# EAGLE design InstrDigitizer (EAGLE 8.0.1)
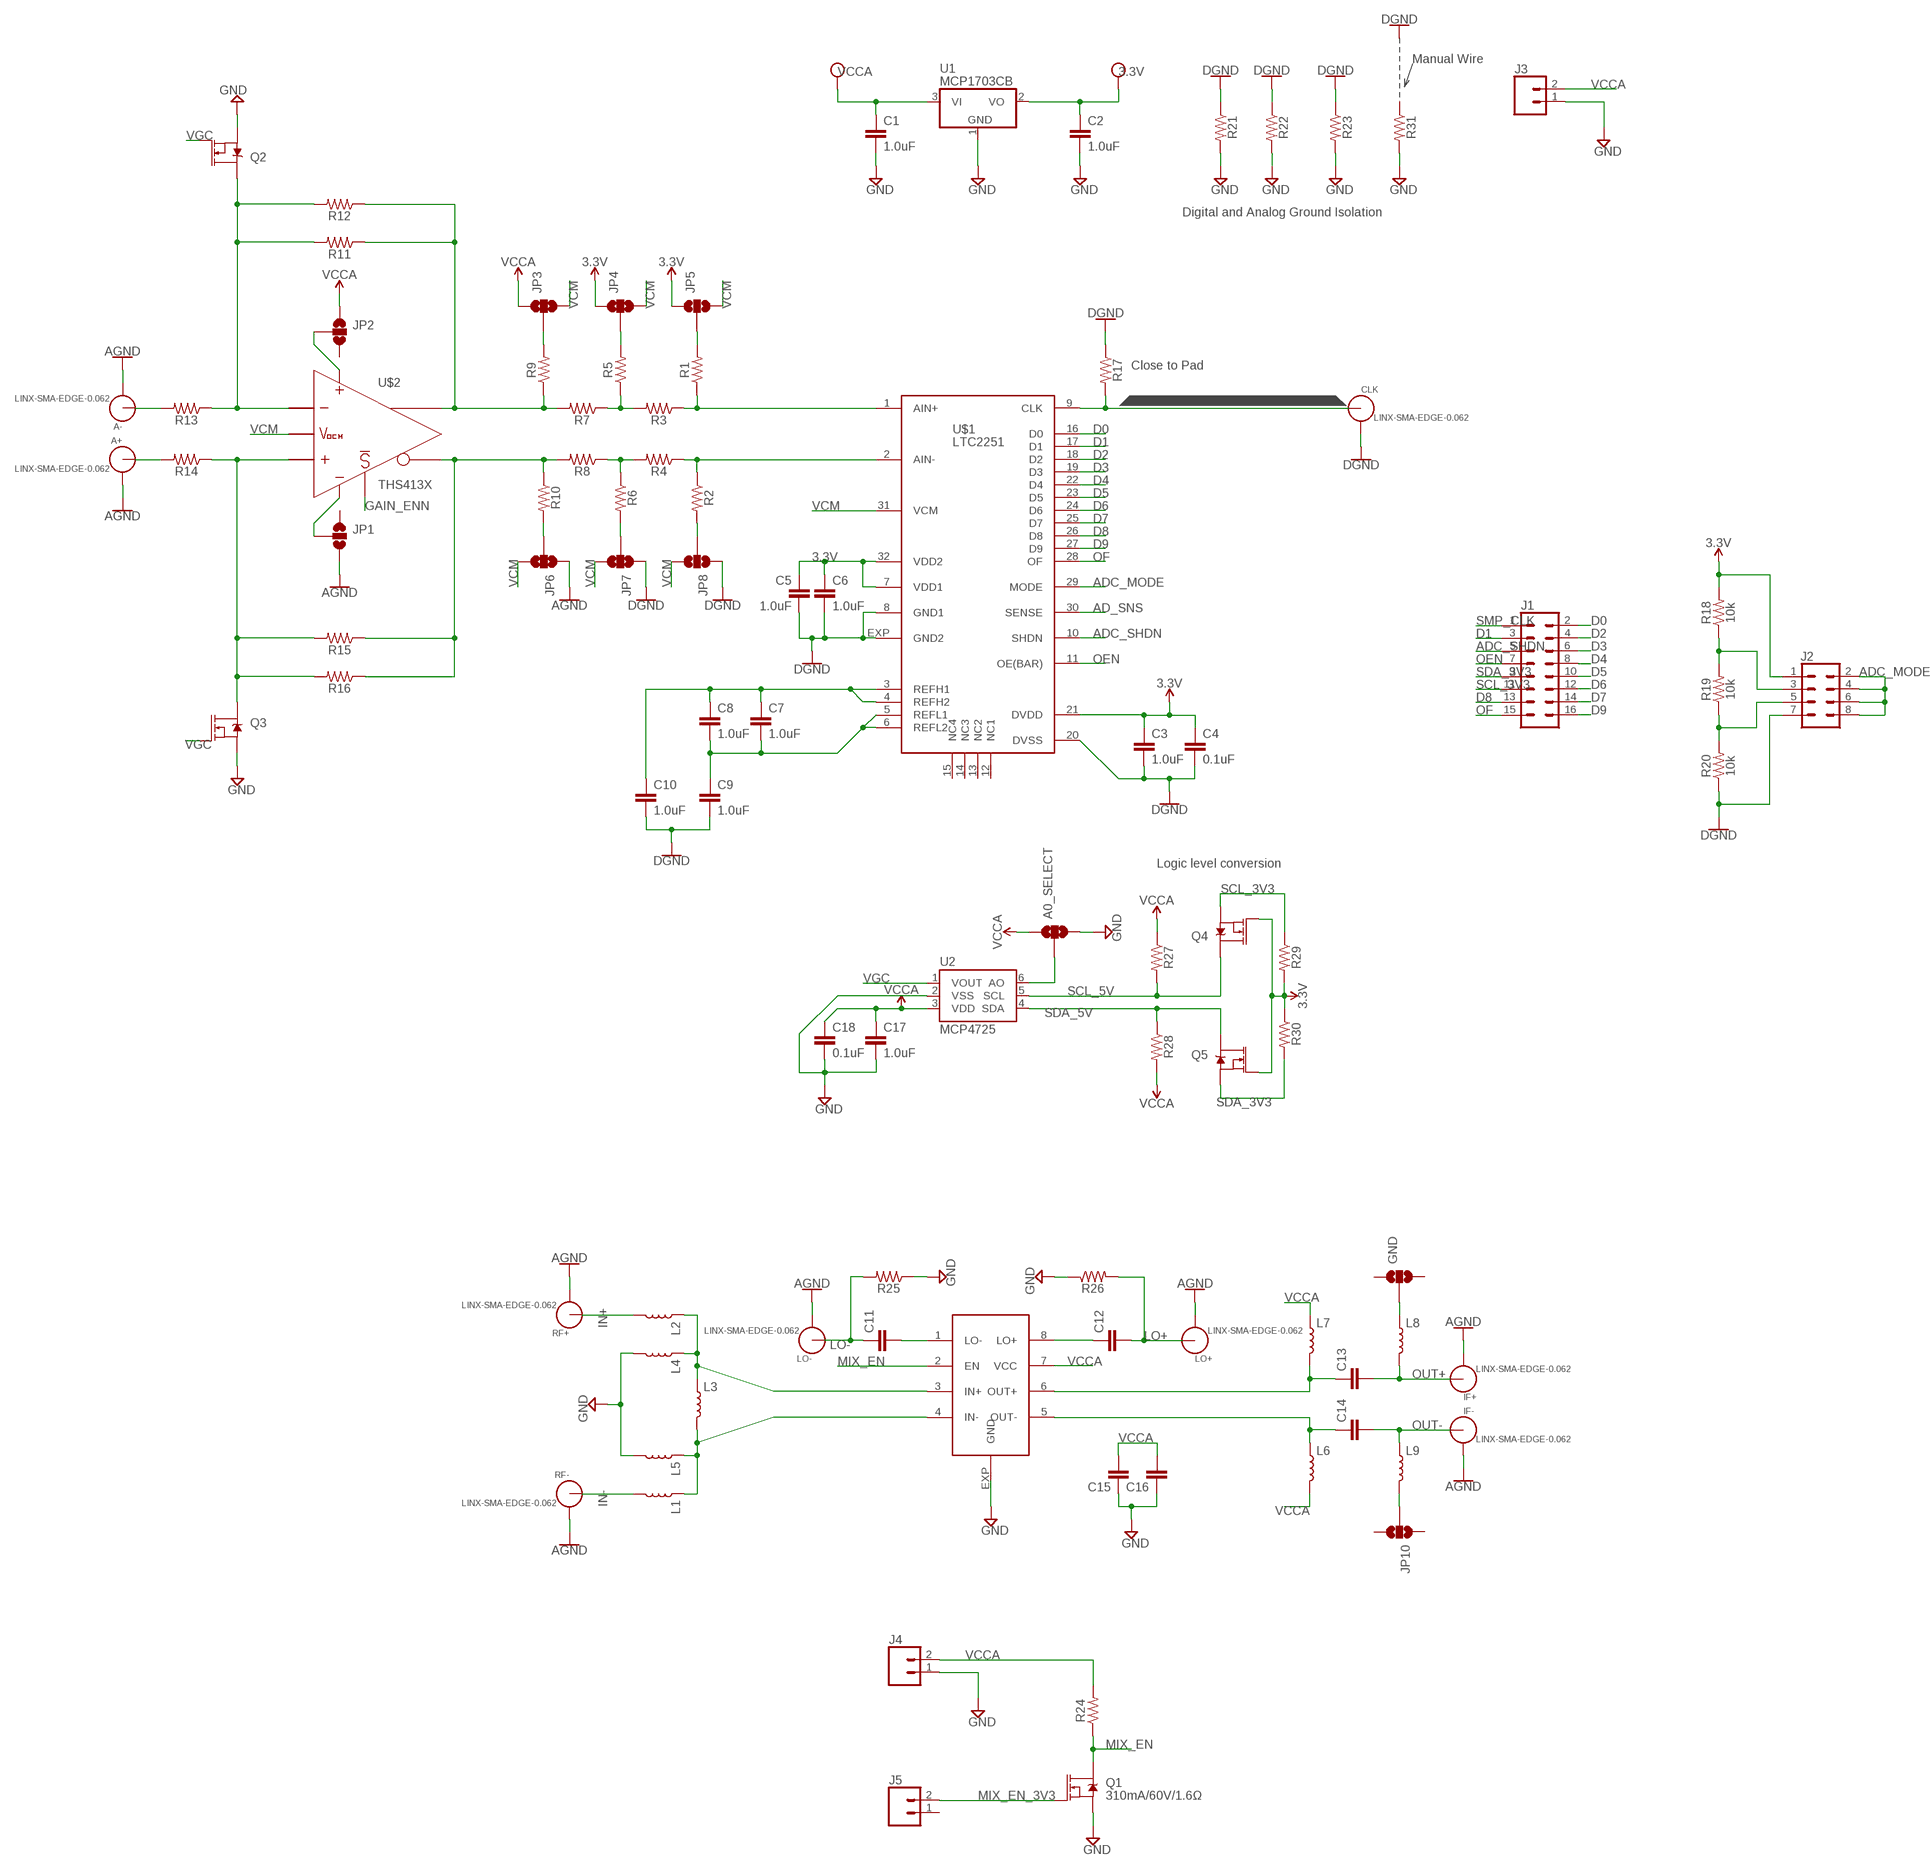
[diagram p0: schematic, sheet 1]

## Parts
A0_SELECT  JUMPER-SMT_3_NO_SILK  [SMT-JUMPER_3_NO_SILK]
A+  LINX-SMA-EDGE-0.062  [CONSMA003.062]
A-  LINX-SMA-EDGE-0.062  [CONSMA003.062]
C1  1.0uF  1.0UF-0402-16V-10%  [0402]
C2  1.0uF  1.0UF-0402-16V-10%  [0402]
C3  1.0uF  1.0UF-0402-16V-10%  [0402]
C4  0.1uF  0.1UF-0402-16V-10%  [0402]
C5  1.0uF  1.0UF-0402-16V-10%  [0402]
C6  1.0uF  1.0UF-0402-16V-10%  [0402]
C7  1.0uF  1.0UF-0402-16V-10%  [0402]
C8  1.0uF  1.0UF-0402-16V-10%  [0402]
C9  1.0uF  1.0UF-0402-16V-10%  [0402]
C10  1.0uF  1.0UF-0402-16V-10%  [0402]
C11  1.0UF-0402-16V-10%  [0402]
C12  1.0UF-0402-16V-10%  [0402]
C13  1.0UF-0402-16V-10%  [0402]
C14  1.0UF-0402-16V-10%  [0402]
C15  1.0UF-0402-16V-10%  [0402]
C16  1.0UF-0402-16V-10%  [0402]
C17  1.0uF  1.0UF-0402-16V-10%  [0402]
C18  0.1uF  0.1UF-0402-16V-10%  [0402]
CLK  LINX-SMA-EDGE-0.062  [CONSMA003.062]
GND  JUMPER-SMT_3_NO_SILK  [SMT-JUMPER_3_NO_SILK]
IF+  LINX-SMA-EDGE-0.062  [CONSMA003.062]
IF-  LINX-SMA-EDGE-0.062  [CONSMA003.062]
J1  CONN_08X2  [2X8]
J2  CONN_04X2  [2X4]
J3  CONN_02  [1X02]
J4  CONN_02  [1X02]
J5  CONN_02  [1X02]
JP1  JUMPER-SMT_3_NO_SILK  [SMT-JUMPER_3_NO_SILK]
JP2  JUMPER-SMT_3_NO_SILK  [SMT-JUMPER_3_NO_SILK]
JP3  JUMPER-SMT_3_NO_SILK  [SMT-JUMPER_3_NO_SILK]
JP4  JUMPER-SMT_3_NO_SILK  [SMT-JUMPER_3_NO_SILK]
JP5  JUMPER-SMT_3_NO_SILK  [SMT-JUMPER_3_NO_SILK]
JP6  JUMPER-SMT_3_NO_SILK  [SMT-JUMPER_3_NO_SILK]
JP7  JUMPER-SMT_3_NO_SILK  [SMT-JUMPER_3_NO_SILK]
JP8  JUMPER-SMT_3_NO_SILK  [SMT-JUMPER_3_NO_SILK]
JP10  JUMPER-SMT_3_NO_SILK  [SMT-JUMPER_3_NO_SILK]
L1  INDUCTOR-0603-33NH  [0603]
L2  INDUCTOR-0603-33NH  [0603]
L3  INDUCTOR-0603-33NH  [0603]
L4  INDUCTOR-0603-33NH  [0603]
L5  INDUCTOR-0603-33NH  [0603]
L6  INDUCTOR-0603-33NH  [0603]
L7  INDUCTOR-0603-33NH  [0603]
L8  INDUCTOR-0603-33NH  [0603]
L9  INDUCTOR-0603-33NH  [0603]
LO+  LINX-SMA-EDGE-0.062  [CONSMA003.062]
LO-  LINX-SMA-EDGE-0.062  [CONSMA003.062]
Q1  310mA/60V/1.6Ω  MOSFET-NCH-2N7002PW  [SOT323]
Q2  MOSFET-NCH-AO3404A  [SOT23-3]
Q3  MOSFET-NCH-AO3404A  [SOT23-3]
Q4  MOSFET-NCH-AO3404A  [SOT23-3]
Q5  MOSFET-NCH-AO3404A  [SOT23-3]
R1  RESISTOR0402  [0402]
R2  RESISTOR0402  [0402]
R3  RESISTOR0402  [0402]
R4  RESISTOR0402  [0402]
R5  RESISTOR0402  [0402]
R6  RESISTOR0402  [0402]
R7  RESISTOR0402  [0402]
R8  RESISTOR0402  [0402]
R9  RESISTOR0402  [0402]
R10  RESISTOR0402  [0402]
R11  RESISTOR0402  [0402]
R12  RESISTOR0402  [0402]
R13  RESISTOR0402  [0402]
R14  RESISTOR0402  [0402]
R15  RESISTOR0402  [0402]
R16  RESISTOR0402  [0402]
R17  RESISTOR0402  [0402]
R18  10k  RESISTOR0402  [0402]
R19  10k  RESISTOR0402  [0402]
R20  10k  RESISTOR0402  [0402]
R21  RESISTOR0402  [0402]
R22  RESISTOR0402  [0402]
R23  RESISTOR0402  [0402]
R24  RESISTOR0402  [0402]
R25  RESISTOR0402  [0402]
R26  RESISTOR0402  [0402]
R27  RESISTOR0402  [0402]
R28  RESISTOR0402  [0402]
R29  RESISTOR0402  [0402]
R30  RESISTOR0402  [0402]
R31  RESISTOR0402  [0402]
RF+  LINX-SMA-EDGE-0.062  [CONSMA003.062]
RF-  LINX-SMA-EDGE-0.062  [CONSMA003.062]
U1  MCP1703CB  [SOT23]
U2  MCP4725  MCP4725SOT-23  [SOT23-6]
U$1  LTC2251  [HVQFN32]
U$2  THS413X  [SO08]
U$9  LT5560  [DFN8-3X3]

## Nets
3.3V: C2.1 C3.1 C4.1 C5.1 C6.1 J2.1 JP4.1 JP5.1 Q4.1(G) Q5.1(G) R18.2 R29.2 R30.1 U1.2(VO) U$1.7(VDD1) U$1.21(DVDD) U$1.32(VDD2) ; supply symbol labelled VDD
AD_SNS: U$1.30(SENSE)
ADC_MODE: J2.2 J2.4 J2.6 J2.8 U$1.29(MODE)
ADC_SHDN: J1.5 U$1.10(SHDN)
AMP+: Q3.3(D) R14.1 R15.2 R16.2 U$2.8
AMP-: Q2.3(D) R11.2 R12.2 R13.1 U$2.1
D0: J1.2 U$1.16(D0)
D1: J1.3 U$1.17(D1)
D2: J1.4 U$1.18(D2)
D3: J1.6 U$1.19(D3)
D4: J1.8 U$1.22(D4)
D5: J1.10 U$1.23(D5)
D6: J1.12 U$1.24(D6)
D7: J1.14 U$1.25(D7)
D8: J1.13 U$1.26(D8)
D9: J1.16 U$1.27(D9)
GAIN_ENN: U$2.7
GND: A0_SELECT.3 A+.GND1 A+.GND2 A+.GND3 A+.GND4 A-.GND1 A-.GND2 A-.GND3 A-.GND4 C1.2 C2.2 C3.2 C4.2 C5.2 C6.2 C9.2 C10.2 C15.1 C16.1 C17.2 C18.2 CLK.GND1 CLK.GND2 CLK.GND3 CLK.GND4 IF+.GND1 IF+.GND2 IF+.GND3 IF+.GND4 IF-.GND1 IF-.GND2 IF-.GND3 IF-.GND4 J2.7 J3.1 J4.1 JP1.3 JP6.1 JP7.1 JP8.1 L4.2 L5.2 LO+.GND1 LO+.GND2 LO+.GND3 LO+.GND4 LO-.GND1 LO-.GND2 LO-.GND3 LO-.GND4 Q1.2(S) Q2.2(S) Q3.2(S) R17.1 R20.1 R21.1 R21.2 R22.1 R22.2 R23.1 R23.2 R25.1 R26.1 R31.2 RF+.GND1 RF+.GND2 RF+.GND3 RF+.GND4 RF-.GND1 RF-.GND2 RF-.GND3 RF-.GND4 U1.1(GND) U2.2(VSS) U$1.8(GND1) U$1.20(DVSS) U$1.EXP(GND2) U$9.EXP(GND) ; supply symbol labelled DGND, AGND
IN+: L2.2 RF+.ANT
IN-: L1.2 RF-.ANT
LO+: C12.2 LO+.ANT R26.2
LO-: C11.1 LO-.ANT R25.2
MIX_EN: Q1.3(D) R24.1 U$9.2(EN)
MIX_EN_3V3: J5.2 Q1.1(G)
N98: L1.1 L3.2 L5.1 U$9.4(IN-)
N$1: JP2.2 U$2.3
N$2: JP1.2 U$2.6
N$3: R7.2 R9.1 R11.1 R12.1 U$2.4
N$4: R3.2 R5.1 R7.1
N$5: R1.1 R3.1 U$1.1(AIN+)
N$6: R8.2 R10.1 R15.1 R16.1 U$2.5
N$7: R4.2 R6.1 R8.1
N$8: R2.1 R4.1 U$1.2(AIN-)
N$9: JP3.2 R9.2
N$10: JP4.2 R5.2
N$11: JP5.2 R1.2
N$12: JP8.2 R2.2
N$13: JP7.2 R6.2
N$14: JP6.2 R10.2
N$15: A-.ANT R13.2
N$16: A+.ANT R14.2
N$20: C11.2 U$9.1(LO-)
N$21: C7.1 C8.1 C10.1 U$1.3(REFH1) U$1.4(REFH2)
N$22: J2.5 R19.1 R20.2
N$23: C7.2 C8.2 C9.1 U$1.5(REFL1) U$1.6(REFL2)
N$24: C12.1 U$9.8(LO+)
N$25: L2.1 L3.1 L4.1 U$9.3(IN+)
N$26: C14.1 L6.1 U$9.5(OUT-)
N$27: C13.1 L7.2 U$9.6(OUT+)
N$30: J2.3 R18.1 R19.2
N$37: GND.2 L8.1
N$38: JP10.2 L9.2
N$39: A0_SELECT.2 U2.6(AO)
OEN: J1.7 U$1.11(OE(BAR))
OF: J1.15 U$1.28(OF)
OUT+: C13.2 IF+.ANT L8.2
OUT-: C14.2 IF-.ANT L9.1
SCL_3V3: J1.11 Q4.2(S) R29.1
SCL_5V: Q4.3(D) R27.2 U2.5(SCL)
SDA_3V3: J1.9 Q5.2(S) R30.2
SDA_5V: Q5.3(D) R28.1 U2.4(SDA)
SMP_CLK: CLK.ANT J1.1 R17.2 U$1.9(CLK)
VCCA: A0_SELECT.1 C1.1 C15.2 C16.2 C17.1 C18.1 J3.2 J4.2 JP2.1 JP3.1 L6.2 L7.1 R24.2 R27.1 R28.2 U1.3(VI) U2.3(VDD) U$9.7(VCC) ; supply symbol labelled VCC
VCM: JP3.3 JP4.3 JP5.3 JP6.3 JP7.3 JP8.3 U$1.31(VCM) U$2.2
VGC: Q2.1(G) Q3.1(G) U2.1(VOUT)
Unconnected: GND.1 GND.3 J5.1 JP1.1 JP2.3 JP10.1 JP10.3 R31.1 U$1.12(NC1) U$1.13(NC2) U$1.14(NC3) U$1.15(NC4)

## Notes on the sheet
- Manual Wire
- Digital and Analog Ground Isolation
- Close to Pad
- Logic level conversion

## Library data of the parts
A0_SELECT GND JP1-JP8 JP10 = SparkFun-Jumpers:JUMPER-SMT_3_NO: Normally open jumper This jumper has three pads in close proximity to each other. Apply solder to close the connection(s).
A+ A- CLK IF+ IF- LO+ LO- RF+ RF- = connector:LINX-SMA-EDGE-0.062: CONN SMA JACK 50 OHM EDGE MNT; DIGIKEY: CONSMA003.062-ND
C1-C3 C5-C10 C17 = SparkFun-Capacitors:1.0UF: 1µF ceramic capacitors A capacitor is a passive two-terminal electrical component used to store electrical energy temporarily in an electric field.; PROD_ID: CAP-12417
C4 C18 = SparkFun-Capacitors:0.1UF: 0.1µF ceramic capacitors A capacitor is a passive two-terminal electrical component used to store electrical energy temporarily in an electric field.; PROD_ID: CAP-12416
C11-C16 = SparkFun-Capacitors:1.0UF: 1µF ceramic capacitors A capacitor is a passive two-terminal electrical component used to store electrical energy temporarily in an electric field.; PROD_ID: CAP-12417; VALUE: 1.0uF
J1 = SparkFun-Connectors:CONN_08X2: Multi connection point. Often used as Generic Header-pin footprint for 0.1 inch spaced/style header connections You can populate with any combo of single row headers, but if you'd like an exact match, check this: Header - 2x8 (Male, 0.1") <https://www.sparkfun.com/products/13156> (PRT-13156) On any of the 0.1 inch spaced packages, you can populate with these: Break Away Headers - Straight <https://www.sparkfun.com/products/116> (PRT-00116) Break Away Male Headers - Right Angle <https://www.sparkfun.com/products/553> (PRT-00553) Female Headers <https://www.sparkfun.com/products/115> (PRT-00115) Break Away Headers - Machine Pin <https://www.sparkfun.com/products/117> (PRT-00117) Break Away Female Headers - Swiss Machine Pin <https://www.sparkfun.com/products/743> (PRT-00743)
J2 = SparkFun-Connectors:CONN_04X2: Multi connection point. Often used as Generic Header-pin footprint for 0.1 inch spaced/style header connections On any of the 0.1 inch spaced packages, you can populate with these: Break Away Headers - Straight <https://www.sparkfun.com/products/116> (PRT-00116) Break Away Male Headers - Right Angle <https://www.sparkfun.com/products/553> (PRT-00553) Female Headers <https://www.sparkfun.com/products/115> (PRT-00115) Break Away Headers - Machine Pin <https://www.sparkfun.com/products/117> (PRT-00117) Break Away Female Headers - Swiss Machine Pin <https://www.sparkfun.com/products/743> (PRT-00743)
J3-J5 = SparkFun-Connectors:CONN_02: Multi connection point. Often used as Generic Header-pin footprint for 0.1 inch spaced/style header connections On any of the 0.1 inch spaced packages, you can populate with these: Break Away Headers - Straight <https://www.sparkfun.com/products/116> (PRT-00116) Break Away Male Headers - Right Angle <https://www.sparkfun.com/products/553> (PRT-00553) Female Headers <https://www.sparkfun.com/products/115> (PRT-00115) Break Away Headers - Machine Pin <https://www.sparkfun.com/products/117> (PRT-00117) Break Away Female Headers - Swiss Machine Pin <https://www.sparkfun.com/products/743> (PRT-00743) For SCREWTERMINALS and SPRING TERMINALS visit here: Screw Terimnals on SparkFun.com <https://www.sparkfun.com/search/results?term=Screw+Terminals> (5mm/3.5mm/2.54mm spacing) This device is also useful as a general connection point to wire up your design to another part of your project. Our various solder wires solder well into these plated through hole pads. Hook-Up Wire - Assortment (Stranded, 22 AWG) <https://www.sparkfun.com/products/11375> (PRT-11375) Hook-Up Wire - Assortment (Solid Core, 22 AWG) <https://www.sparkfun.com/products/11367> (PRT-11367) View the entire wire category on our website here <https://www.sparkfun.com/categories/141> Special notes: Molex polarized connector foot print use with: PRT-08233 with associated crimp pins and housings. 2.54_SCREWTERM for use with PRT-10571. 3.5mm Screw Terminal footprints for PRT-08084 5mm Screw Terminal footprints for use with PRT-08432
L1-L9 = SparkFun-Coils:INDUCTOR: Inductors Resist changes in electrical current. Basically a coil of wire. SparkFun Products: SparkFun Load Cell Amplifier - HX711 <https://www.sparkfun.com/products/13879> IOIO-OTG - V2.2 <https://www.sparkfun.com/products/13613>; PROD_ID: NDUC-07874; VALUE: 33nH/±5%/500mA
Q1 = SparkFun-DiscreteSemi:MOSFET-NCH: N-channel MOSFETs Voltage controlled devices that allow control of high current outputs. SparkFun Products: SparkFun OpenScale <https://www.sparkfun.com/products/13261> SparkFun Digital Sandbox <https://www.sparkfun.com/products/12651> SparkFun Monster Moto Shield <https://www.sparkfun.com/products/10182> SparkFun MOSFET Power Controller <https://www.sparkfun.com/products/11214>; PROD_ID: TRANS-11151
Q2-Q5 = SparkFun-DiscreteSemi:MOSFET-NCH: N-channel MOSFETs Voltage controlled devices that allow control of high current outputs. SparkFun Products: SparkFun OpenScale <https://www.sparkfun.com/products/13261> SparkFun Digital Sandbox <https://www.sparkfun.com/products/12651> SparkFun Monster Moto Shield <https://www.sparkfun.com/products/10182> SparkFun MOSFET Power Controller <https://www.sparkfun.com/products/11214>; PROD_ID: TRANS-12988; VALUE: 5.8A/30V/35mΩ
R1-R31 = SparkFun-Resistors:RESISTOR: Generic Resistor Package
U1 = linear:MCP1703: 250 mA, 16V, Low Quiescent Current LDO Regulator Source: http://ww1.microchip.com/downloads/en/DeviceDoc/22049b.pdf
U2 = SparkFun-IC-Conversion:MCP4725: MCP4725 DAC Microchip 12-bit I2C DAC, SOT23-6 Datasheet <https://cdn.sparkfun.com/datasheets/BreakoutBoards/MCP4725_2009.pdf> SparkFun Products SparkFun I2C DAC Breakout - MCP4725 <https://www.sparkfun.com/products/12918> (BOB-12918); PROD_ID: IC-08886
U$1 = components:LTC2251: LTC2251 125MSPS Pipelined ADC
U$2 = components:THS413X
U$9 = components:LT5560

## Board
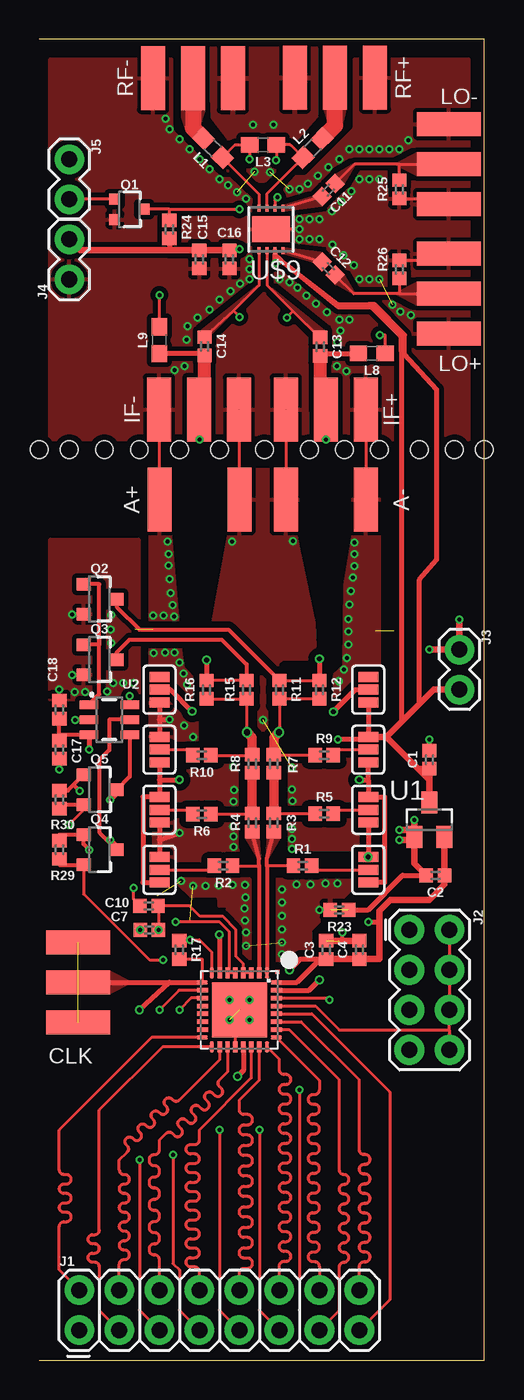
[diagram p1: board, top side]
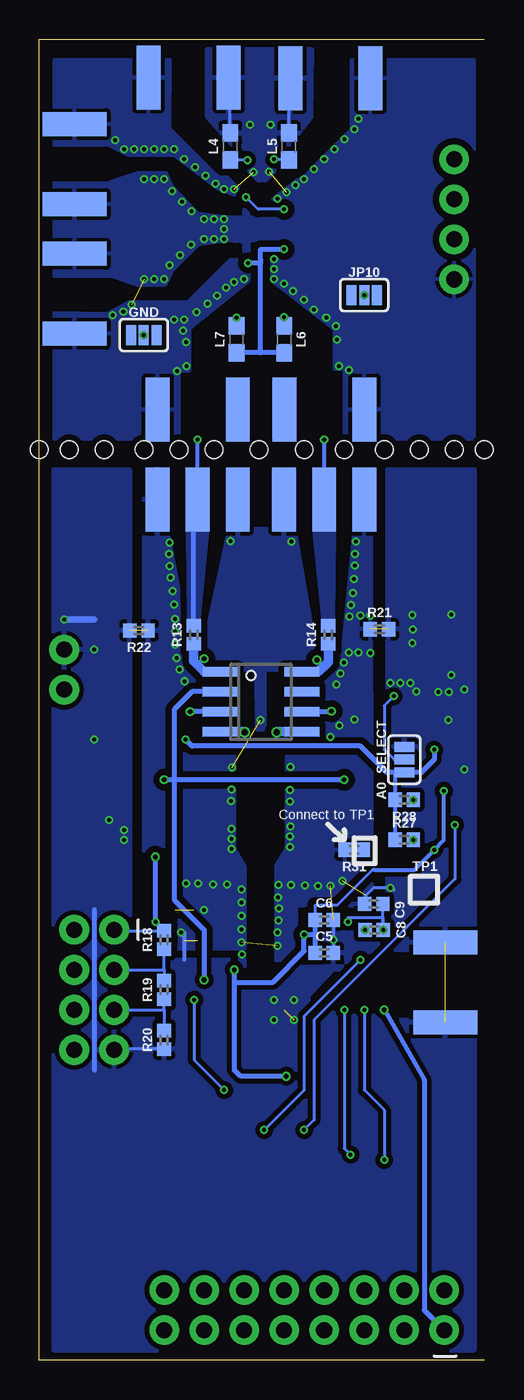
[diagram p2: board, bottom side, seen from below]

Size 28.25 x 83.81 mm. Coordinates in mm from the lower left corner, seen from the top.
Outline: 0,0 28.25,0 28.25,83.81 0,83.81
Copper layers (1*16): Top 0.0356mm / dielectric 60mil / Bottom 0.0356mm
Design rules "default *": minimum track width 6mil, minimum drill 10mil, track to track 6mil, track to pad 6mil, pad to pad 6mil, via to via 6mil, smd to smd 0mil, copper to edge 15mil, drill to drill 10mil, minimum pad ring 5mil, minimum via ring 5mil, stop-mask expansion 4mil, vias tented up to drill 20mil, thermal gap 10mil
Holes 1.1 mm at 0,57.78 1.91,57.78 6.35,57.78 8.89,57.78 11.43,57.78 14.29,57.78 17.14,57.78 19.37,57.78 21.59,57.78 24.13,57.78 26.35,57.78 28.26,57.78 4.13,57.78

### Footprints (pad centres in the part's own frame; a part is rotated, then mirrored left to right if it is on the bottom)
SMT-JUMPER_3_NO_SILK = smd 0.635 x 1.27: 1 -0.813,0; 2 0,0; 3 0.813,0
CONSMA003.062 = smd 4.06 x 1.52: ANT 0,0; GND1 0,2.54; GND2 0,-2.54 | smd 4.06 x 1.52 bottom: GND3 0,2.54; GND4 0,-2.54
0402 = smd 0.85 x 0.9: 1 -0.58,0; 2 0.58,0
2X8 = drill 1.016 pad 1.88: 1 0,0; 2 0,2.54; 3 2.54,0; 4 2.54,2.54; 5 5.08,0; 6 5.08,2.54; 7 7.62,0; 8 7.62,2.54; 9 10.16,0; 10 10.16,2.54; 11 12.7,0; 12 12.7,2.54; 13 15.24,0; 14 15.24,2.54; 15 17.78,0; 16 17.78,2.54
2X4 = drill 1.016 pad 1.88: 1 -3.81,-1.27; 2 -3.81,1.27; 3 -1.27,-1.27; 4 -1.27,1.27; 5 1.27,-1.27; 6 1.27,1.27; 7 3.81,-1.27; 8 3.81,1.27
1X02 = drill 1.016 pad 1.88: 1 0,0; 2 2.54,0
0603 = smd 1.1 x 1: 1 -0.85,0; 2 0.85,0
SOT323 = smd 0.7 x 0.7: 1 -0.65,-0.925; 2 0.65,-0.925; 3 0,0.925
SOT23-3 = smd 0.8 x 0.9: 1 -0.95,-1; 2 0.95,-1; 3 0,1.1
SOT23 = smd 1 x 1.4: 1 -0.95,-1.1; 2 0.95,-1.1; 3 0,1.1
SOT23-6 = smd 0.55 x 1.2: 1 0.95,1.3; 2 0,1.3; 3 -0.95,1.3; 4 -0.95,-1.3; 5 0,-1.3; 6 0.95,-1.3
HVQFN32 = smd 0.7 x 0.28: 1 -2.35,1.75; 2 -2.35,1.25; 3 -2.35,0.75; 4 -2.35,0.25; 5 -2.35,-0.25; 6 -2.35,-0.75; 7 -2.35,-1.25; 8 -2.35,-1.75; 17 2.35,-1.75; 18 2.35,-1.25; 19 2.35,-0.75; 20 2.35,-0.25; 21 2.35,0.25; 22 2.35,0.75; 23 2.35,1.25; 24 2.35,1.75 | smd 0.28 x 0.7: 9 -1.75,-2.35; 10 -1.25,-2.35; 11 -0.75,-2.35; 12 -0.25,-2.35; 13 0.25,-2.35; 14 0.75,-2.35; 15 1.25,-2.35; 16 1.75,-2.35; 25 1.75,2.35; 26 1.25,2.35; 27 0.75,2.35; 28 0.25,2.35; 29 -0.25,2.35; 30 -0.75,2.35; 31 -1.25,2.35; 32 -1.75,2.35 | smd 3.5 x 3.5: EXP 0,0 | smd 0.25 x 0.25: M1 -2.415,2.415
SO08 = smd 0.6 x 2.2: 1 -1.905,-2.6; 2 -0.635,-2.6; 3 0.635,-2.6; 4 1.905,-2.6; 5 1.905,2.6; 6 0.635,2.6; 7 -0.635,2.6; 8 -1.905,2.6
DFN8-3X3 = smd 0.25 x 0.45: 1 -0.75,-1.35; 2 -0.25,-1.35; 3 0.25,-1.35; 4 0.75,-1.35; 5 0.75,1.35; 6 0.25,1.35; 7 -0.25,1.35; 8 -0.75,1.35 | smd 2.38 x 1.65: EXP 0,0

### Placement (x,y rotation side)
A0_SELECT  5.08,38.1 90 bottom
A+  10.16,54.61 90 bottom
A-  18.19,54.61 270 bottom
C1  24.77,38.1 90 top
C2  25.15,30.76 180 top
C3  18.21,26.04 90 top
C4  20.32,26.04 90 top
C5  10.16,25.83 0 bottom
C6  10.16,27.94 0 bottom
C7  6.99,27.3 180 top
C8  6.99,27.3 0 bottom
C9  7.01,28.96 180 bottom
C10  6.96,28.83 180 top
C11  18.36,74.24 225 top
C12  18.36,69.27 315 top
C13  17.83,64.31 270 top
C14  10.49,64.34 270 top
C15  10.16,69.85 90 top
C16  12.06,69.85 90 top
C17  1.27,38.73 270 top
C18  1.27,41.27 90 top
CLK  2.46,23.98 0 top
GND  21.62,65.05 0 bottom
IF+  18.19,60.33 90 top
IF-  10.13,60.33 270 top
J1  2.54,1.91 0 top
J2  24.77,23.5 270 top
J3  26.67,45.09 270 top
J4  1.91,68.58 90 top
J5  1.91,76.2 270 top
JP1  7.62,42.55 270 top
JP2  20.88,42.55 90 top
JP3  20.88,38.73 270 top
JP4  20.88,34.92 90 top
JP5  20.88,31.11 270 top
JP6  7.62,38.73 270 top
JP7  7.62,34.92 90 top
JP8  7.62,31.11 270 top
JP10  7.62,67.59 0 bottom
L1  11.02,76.91 135 top
L2  17.35,76.91 45 top
L3  14.2,77.11 180 top
L4  16.13,77.01 90 bottom
L5  12.4,77.01 90 bottom
L6  12.7,64.77 270 bottom
L7  15.72,64.77 90 bottom
L8  21.11,63.88 180 top
L9  7.62,64.72 90 top
LO+  26.01,67.67 0 top
LO-  26.01,75.9 0 top
Q1  5.71,73.03 270 top
Q2  3.81,48.29 270 top
Q3  3.81,44.45 270 top
Q4  3.81,32.38 270 top
Q5  3.81,36.2 270 top
R1  16.71,31.37 0 top
R2  11.68,31.37 180 top
R3  14.88,34.11 90 top
R4  13.51,34.11 90 top
R5  18.08,34.67 0 top
R6  10.31,34.65 180 top
R7  14.88,37.85 90 top
R8  13.51,37.85 90 top
R9  18.08,38.38 0 top
R10  10.31,38.38 180 top
R11  15.24,42.55 90 top
R12  17.78,42.55 90 top
R13  18.44,46.02 90 bottom
R14  9.91,46.02 90 bottom
R15  13.16,42.55 90 top
R16  10.62,42.55 90 top
R17  8.89,26.04 270 top
R18  20.32,26.67 90 bottom
R19  20.32,23.5 90 bottom
R20  20.32,20.32 90 bottom
R21  6.65,46.38 0 bottom
R22  21.92,46.3 180 bottom
R23  19.05,28.57 180 top
R24  8.26,71.75 270 top
R25  22.86,74.3 90 top
R26  22.86,69.22 270 top
R27  5.08,33.02 0 bottom
R28  5.08,35.56 180 bottom
R29  1.27,32.38 90 top
R30  1.27,35.56 270 top
R31  8.26,32.38 180 bottom
RF+  18.77,81.38 270 top
RF-  9.75,81.36 90 top
U1  24.77,34.29 0 top
U2  4.45,40.64 90 top
U$1  12.7,22.23 270 top
U$2  14.17,41.78 270 bottom
U$9  14.71,71.75 180 top

### Tracks (layer width: path | path; a pad name or v marks a point on that pad's centre or on a via)
3.3V  (via drill 0.25 pad 0.25, 0.3 pad 0.25, 0.3 pad 0.41)
  Top 0.203: 11.45,26.98 v11.43,27 | C3.1 17.84,25.45
  Top 0.254: 2.16,36.5 Q5.1 | 2.16,36.5 1.8,36.14 R30.1 | R29.2 1.27,33.34 Q4.1 2.81,32.75 v3.17,32.38 | v2.56,36.12 2.19,36.5 2.16,36.5
  Top 0.305: U$1.21 12.95,18.39 v12.57,18.01 | 11.45,26.98 U$1.7 | JP4.1 JP5.1 | U$1.32 16.36,23.98 17.84,25.45 | v15.88,24.77 16.57,25.45 C3.1 | v20.88,27.81 21.59,27.81
  Top 0.406: C3.1 C4.1 21.59,25.45 21.59,27.81 21.59,28.5 22.3,29.21 24.77,29.21 25.73,30.17 C2.1 25.71,30.77 U1.2
  Bottom 0.203: R18.2 23.44,27.25 J2.1 | 6.99,31.11 7.09,31.11 9.35,28.85 10.74,28.85 C6.1
  Bottom 0.254: 6.99,31.11 4.45,31.11 v3.17,32.38 2.56,32.99 v2.56,36.12
  Bottom 0.305: 10.74,27 C5.1 | 10.74,27 v11.43,27 11.43,25.96 13.41,23.98 15.88,23.98 15.88,24.13 | v12.57,18.01 15.47,18.01 15.88,18.41 15.88,24.13 | v15.88,24.77 15.88,24.13 | R18.2 v20.88,27.81 JP5.1 | C6.1 10.74,27
  other vias: 20.88,31.93
AD_SNS  (via drill 0.25 pad 0.25)
  Top 0.203: U$1.30 18.3,22.98 v18.41,22.86 | v16.51,17.14 16.51,3.17
  Bottom 0.203: v18.41,22.86 18.41,19.05 v16.51,17.14
ADC_MODE
  Top 0.203: U$1.29 17.53,22.48 19.05,20.95 26.04,20.95 | J2.2 J2.4 J2.6 26.04,20.95 | 26.04,20.95 J2.8
ADC_SHDN  (via drill 0.25 pad 0.25)
  Top 0.203: U$1.10 8.87,23.48 v7.62,22.23 | v6.35,12.7 6.35,3.17 J1.5
  Bottom 0.203: v7.62,22.23 7.62,17.14 6.35,15.88 v6.35,12.7
AMP+  (via drill 0.3 pad 0.25)
  Top 0.203: R15.2 R16.2
  Top 0.254: Q3.3 4.91,44.91 5.71,45.72 11.58,45.72 13.16,44.15 R15.2
  Top 0.305: v10.62,44.42 R16.2
  Bottom 0.254: v10.62,44.42 10.08,43.87 11.45,43.81 U$2.8
  Bottom 0.61: U$2.8 10.52,43.69 9.91,44.3 R14.1
AMP-  (via drill 0.3 pad 0.25)
  Top 0.203: R11.2 R12.2
  Top 0.254: Q2.3 4.91,47.8 6.35,46.35 12.01,46.35 R11.2
  Top 0.305: v17.78,44.5 R12.2
  Bottom 0.254: v17.78,44.5 18.34,44.02 17.86,43.69 16.88,43.79 U$2.1
  Bottom 0.61: U$2.1 17.78,43.69 18.44,44.35 R13.1
  pour Bottom (no thermals): 16.51,43.81 16.51,43.54 16.54,43.51 16.99,43.81
D0
  Top 0.203: U$1.16 7.14,20.48 1.27,14.61 1.27,12.06 arc90 1.56,11.77 1.72,11.77 arc-90 2.02,11.48 2.02,11.47 arc-90 1.72,11.17 1.56,11.17 arc90 1.27,10.88 1.27,10.87 arc90 1.56,10.58 1.72,10.58 arc-90 2.02,10.28 2.02,10.27 arc-90 1.72,9.98 1.56,9.98 arc90 1.27,9.69 1.27,9.67 arc90 1.56,9.38 1.72,9.38 arc-90 2.02,9.09 2.02,9.07 arc-90 1.72,8.78 1.56,8.78 arc90 1.27,8.49 1.27,5.71 J1.2
D1
  Top 0.203: U$1.17 7.81,19.88 3.81,15.88 3.81,8.26 arc-90 3.52,7.96 3.38,7.96 arc90 3.09,7.67 3.09,7.67 arc90 3.38,7.38 3.52,7.38 arc-90 3.81,7.09 3.81,7.08 arc-90 3.52,6.79 3.38,6.79 arc90 3.09,6.5 3.09,6.5 arc90 3.38,6.21 3.52,6.21 arc-90 3.81,5.92 3.81,3.17 J1.3
D2
  Top 0.203: U$1.18 11.43,19.86 11.43,19.05 8.89,16.51 arc-90 8.48,16.51 8.43,16.56 arc90 8.01,16.56 8.01,16.56 arc90 8.01,16.15 8.06,16.09 arc-90 8.06,15.68 8.06,15.68 arc-90 7.65,15.68 7.59,15.73 arc90 7.18,15.73 7.18,15.73 arc90 7.18,15.32 7.23,15.27 arc-90 7.23,14.85 7.23,14.85 arc-90 6.82,14.85 6.76,14.9 arc90 6.35,14.9 6.35,14.9 arc90 6.35,14.49 6.4,14.44 arc-90 6.4,14.02 6.4,14.02 arc-90 5.99,14.02 5.93,14.07 arc90 5.52,14.07 5.52,14.07 arc90 5.52,13.66 5.57,13.61 arc-90 5.57,13.19 5.08,12.7 5.08,12.06 arc90 5.37,11.77 5.42,11.77 arc-90 5.71,11.48 5.71,11.47 arc-90 5.42,11.17 5.37,11.17 arc90 5.08,10.88 5.08,10.87 arc90 5.37,10.57 5.42,10.57 arc-90 5.71,10.28 5.71,10.27 arc-90 5.42,9.98 5.37,9.98 arc90 5.08,9.68 5.08,9.67 arc90 5.37,9.38 5.42,9.38 arc-90 5.71,9.09 5.71,9.07 arc-90 5.42,8.78 5.37,8.78 arc90 5.08,8.49 5.08,8.47 arc90 5.37,8.18 5.42,8.18 arc-90 5.71,7.89 5.71,7.87 arc-90 5.42,7.58 5.37,7.58 arc90 5.08,7.29 5.08,7.28 arc90 5.37,6.98 5.42,6.98 arc-90 5.71,6.69 5.71,6.68 arc-90 5.42,6.38 5.37,6.38 arc90 5.08,6.09 J1.4
D3
  Top 0.203: U$1.19 11.95,18.3 11.43,17.78 arc90 11.43,17.37 11.56,17.24 arc-90 11.56,16.83 11.54,16.81 arc-90 11.13,16.81 11,16.94 arc90 10.59,16.94 10.58,16.93 arc90 10.58,16.52 10.71,16.39 arc-90 10.71,15.97 10.69,15.96 arc-90 10.28,15.96 10.15,16.09 arc90 9.74,16.09 9.73,16.08 arc90 9.73,15.66 9.85,15.54 arc-90 9.85,15.12 9.84,15.11 arc-90 9.43,15.11 9.3,15.24 arc90 8.89,15.24 8.87,15.22 arc90 8.87,14.81 9,14.68 arc-90 9,14.27 8.99,14.26 arc-90 8.57,14.26 8.45,14.38 arc90 8.04,14.38 7.62,13.97 7.62,13.34 arc-90 7.33,13.04 7.28,13.04 arc90 6.99,12.75 6.99,12.63 arc90 7.28,12.34 7.33,12.34 arc-90 7.62,12.04 7.62,11.92 arc-90 7.33,11.63 7.28,11.63 arc90 6.99,11.34 6.99,11.21 arc90 7.28,10.92 7.33,10.92 arc-90 7.62,10.63 7.62,10.5 arc-90 7.33,10.21 7.28,10.21 arc90 6.99,9.92 6.99,9.8 arc90 7.28,9.5 7.33,9.5 arc-90 7.62,9.21 7.62,9.09 arc-90 7.33,8.8 7.28,8.8 arc90 6.99,8.5 6.99,8.38 arc90 7.28,8.09 7.33,8.09 arc-90 7.62,7.8 7.62,7.67 arc-90 7.33,7.38 7.28,7.38 arc90 6.99,7.09 6.99,6.96 arc90 7.28,6.67 7.33,6.67 arc-90 7.62,6.38 J1.6
D4
  Top 0.203: U$1.22 13.45,17.89 10.16,14.61 10.16,13.97 arc-90 9.87,13.68 9.6,13.68 arc90 9.31,13.39 9.31,13.37 arc90 9.6,13.08 9.87,13.08 arc-90 10.16,12.79 10.16,12.78 arc-90 9.87,12.48 9.6,12.48 arc90 9.31,12.19 9.31,12.18 arc90 9.6,11.88 9.87,11.88 arc-90 10.16,11.59 10.16,11.58 arc-90 9.87,11.29 9.6,11.29 arc90 9.31,11 9.31,10.98 arc90 9.6,10.69 9.87,10.69 arc-90 10.16,10.4 10.16,10.38 arc-90 9.87,10.09 9.6,10.09 arc90 9.31,9.8 9.31,9.79 arc90 9.6,9.49 9.87,9.49 arc-90 10.16,9.2 10.16,9.19 arc-90 9.87,8.9 9.6,8.9 arc90 9.31,8.61 9.31,8.59 arc90 9.6,8.3 9.87,8.3 arc-90 10.16,8.01 10.16,8 arc-90 9.87,7.7 9.6,7.7 arc90 9.31,7.41 9.31,7.4 arc90 9.6,7.11 9.87,7.11 arc-90 10.16,6.81 10.16,6.8 arc-90 9.87,6.51 9.6,6.51 arc90 9.31,6.21 9.31,6.2 arc90 9.6,5.91 9.87,5.91 arc-90 10.16,5.62 J1.8
D5
  Top 0.203: U$1.23 13.95,17.76 12.7,16.51 12.7,15.88 arc90 12.99,15.58 13.23,15.58 arc-90 13.53,15.29 13.53,15.22 arc-90 13.23,14.93 12.99,14.93 arc90 12.7,14.64 12.7,14.57 arc90 12.99,14.28 13.23,14.28 arc-90 13.53,13.99 13.53,13.92 arc-90 13.23,13.63 12.99,13.63 arc90 12.7,13.34 12.7,13.27 arc90 12.99,12.98 13.23,12.98 arc-90 13.53,12.69 13.53,12.62 arc-90 13.23,12.33 12.99,12.33 arc90 12.7,12.04 12.7,11.97 arc90 12.99,11.68 13.23,11.68 arc-90 13.53,11.39 13.53,11.32 arc-90 13.23,11.03 12.99,11.03 arc90 12.7,10.74 12.7,10.67 arc90 12.99,10.38 13.23,10.38 arc-90 13.53,10.09 13.53,10.02 arc-90 13.23,9.73 12.99,9.73 arc90 12.7,9.44 12.7,9.37 arc90 12.99,9.08 13.23,9.08 arc-90 13.53,8.79 13.53,8.72 arc-90 13.23,8.43 12.99,8.43 arc90 12.7,8.13 12.7,8.07 arc90 12.99,7.78 13.23,7.78 arc-90 13.53,7.49 13.53,7.42 arc-90 13.23,7.13 12.99,7.13 arc90 12.7,6.83 12.7,6.77 arc90 12.99,6.48 13.23,6.48 arc-90 13.53,6.18 13.53,6.12 arc-90 13.23,5.83 12.99,5.83 arc90 12.7,5.53 J1.10
D6
  Top 0.203: U$1.24 15.24,19.09 15.24,18.41 arc90 15.53,18.12 15.67,18.12 arc-90 15.96,17.83 15.96,17.79 arc-90 15.67,17.5 15.53,17.5 arc90 15.24,17.21 15.24,17.17 arc90 15.53,16.88 15.67,16.88 arc-90 15.96,16.58 15.96,16.54 arc-90 15.67,16.25 15.53,16.25 arc90 15.24,15.96 15.24,15.92 arc90 15.53,15.63 15.67,15.63 arc-90 15.96,15.34 15.96,15.3 arc-90 15.67,15 15.53,15 arc90 15.24,14.71 15.24,14.67 arc90 15.53,14.38 15.67,14.38 arc-90 15.96,14.09 15.96,14.05 arc-90 15.67,13.76 15.53,13.76 arc90 15.24,13.46 15.24,13.43 arc90 15.53,13.13 15.67,13.13 arc-90 15.96,12.84 15.96,12.8 arc-90 15.67,12.51 15.53,12.51 arc90 15.24,12.22 15.24,12.18 arc90 15.53,11.88 15.67,11.88 arc-90 15.96,11.59 15.96,11.55 arc-90 15.67,11.26 15.53,11.26 arc90 15.24,10.97 15.24,10.93 arc90 15.53,10.64 15.67,10.64 arc-90 15.96,10.35 15.96,10.31 arc-90 15.67,10.01 15.53,10.01 arc90 15.24,9.72 15.24,9.68 arc90 15.53,9.39 15.67,9.39 arc-90 15.96,9.1 15.96,9.06 arc-90 15.67,8.77 15.53,8.77 arc90 15.24,8.47 15.24,8.43 arc90 15.53,8.14 15.67,8.14 arc-90 15.96,7.85 15.96,7.81 arc-90 15.67,7.52 15.53,7.52 arc90 15.24,7.23 15.24,7.19 arc90 15.53,6.89 15.67,6.89 arc-90 15.96,6.6 15.96,6.56 arc-90 15.67,6.27 15.53,6.27 arc90 15.24,5.98 J1.12
D7
  Top 0.203: U$1.25 17.78,17.75 17.78,17.14 arc-90 17.49,16.85 17.38,16.85 arc90 17.09,16.56 17.09,16.52 arc90 17.38,16.23 17.49,16.23 arc-90 17.78,15.94 17.78,15.9 arc-90 17.49,15.6 17.38,15.6 arc90 17.09,15.31 17.09,15.27 arc90 17.38,14.98 17.49,14.98 arc-90 17.78,14.69 17.78,14.65 arc-90 17.49,14.36 17.38,14.36 arc90 17.09,14.06 17.09,14.02 arc90 17.38,13.73 17.49,13.73 arc-90 17.78,13.44 17.78,13.4 arc-90 17.49,13.11 17.38,13.11 arc90 17.09,12.81 17.09,12.78 arc90 17.38,12.48 17.49,12.48 arc-90 17.78,12.19 17.78,12.15 arc-90 17.49,11.86 17.38,11.86 arc90 17.09,11.57 17.09,11.53 arc90 17.38,11.23 17.49,11.23 arc-90 17.78,10.94 17.78,10.9 arc-90 17.49,10.61 17.38,10.61 arc90 17.09,10.32 17.09,10.28 arc90 17.38,9.98 17.49,9.98 arc-90 17.78,9.69 17.78,9.65 arc-90 17.49,9.36 17.38,9.36 arc90 17.09,9.07 17.09,9.03 arc90 17.38,8.74 17.49,8.74 arc-90 17.78,8.45 17.78,8.4 arc-90 17.49,8.11 17.38,8.11 arc90 17.09,7.82 17.09,7.78 arc90 17.38,7.49 17.49,7.49 arc-90 17.78,7.2 17.78,7.16 arc-90 17.49,6.86 17.38,6.86 arc90 17.09,6.57 17.09,6.53 arc90 17.38,6.24 17.49,6.24 arc-90 17.78,5.95 J1.14
D8
  Top 0.203: U$1.26 15.86,20.98 19.05,17.78 19.05,12.06 arc90 19.34,11.77 19.35,11.77 arc-90 19.64,11.48 19.64,11.45 arc-90 19.35,11.15 19.34,11.15 arc90 19.05,10.86 19.05,10.83 arc90 19.34,10.54 19.35,10.54 arc-90 19.64,10.25 19.64,10.21 arc-90 19.35,9.92 19.34,9.92 arc90 19.05,9.63 19.05,9.6 arc90 19.34,9.3 19.35,9.3 arc-90 19.64,9.01 19.64,8.98 arc-90 19.35,8.69 19.34,8.69 arc90 19.05,8.39 19.05,8.36 arc90 19.34,8.07 19.35,8.07 arc-90 19.64,7.78 19.64,7.74 arc-90 19.35,7.45 19.34,7.45 arc90 19.05,7.16 19.05,7.12 arc90 19.34,6.83 19.35,6.83 arc-90 19.64,6.54 19.64,6.51 arc-90 19.35,6.21 19.34,6.21 arc90 19.05,5.92 19.05,3.17 J1.13
D9
  Top 0.203: U$1.27 16.62,21.48 20.32,17.78 20.32,13.34 arc90 20.61,13.04 20.7,13.04 arc-90 20.99,12.75 20.99,12.72 arc-90 20.7,12.42 20.61,12.42 arc90 20.32,12.13 20.32,12.1 arc90 20.61,11.81 20.7,11.81 arc-90 20.99,11.51 20.99,11.48 arc-90 20.7,11.19 20.61,11.19 arc90 20.32,10.89 20.32,10.86 arc90 20.61,10.57 20.7,10.57 arc-90 20.99,10.28 20.99,10.24 arc-90 20.7,9.95 20.61,9.95 arc90 20.32,9.66 20.32,9.62 arc90 20.61,9.33 20.7,9.33 arc-90 20.99,9.04 20.99,9.01 arc-90 20.7,8.71 20.61,8.71 arc90 20.32,8.42 20.32,8.39 arc90 20.61,8.1 20.7,8.1 arc-90 20.99,7.8 20.99,7.77 arc-90 20.7,7.48 20.61,7.48 arc90 20.32,7.18 20.32,7.15 arc90 20.61,6.86 20.7,6.86 arc-90 20.99,6.57 20.99,6.53 arc-90 20.7,6.24 20.61,6.24 arc90 20.32,5.95 J1.16
GND  (via drill 0.25 pad 0.25, 0.25 pad 0.3)  (17 unrouted)
  Top 0.203: C3.2 18.16,26.67 | U$1.8 10.95,25.88 10.16,26.67 v9.58,26.67 9.53,26.61 R17.1 | v12.06,21.59 12.45,21.2 U$1.20 | R26.1 25.62,69.8 arc90 LO+.GND1 | R25.1 25.68,73.72 arc-90 LO-.GND4 | IF-.GND4 7.59,54.61 A+.GND4 | IF-.GND1 12.68,54.61 A+.GND3 | IF+.GND4 A-.GND4 | IF+.GND1 A-.GND3 | v16.51,71.75 U$9.EXP | C10.2 5.97,29.24 v5.97,29.97
  Top 0.254: 19.05,26.61 19.25,26.61 v19.25,27.13 | Q2.2 2.81,47.32 v2.08,47.32 | Q3.2 2.81,43.48 v2.08,43.48 | C18.2 v1.27,42.55 | C17.2 v1.27,37.47 | U2.2 2.29,40.64 v2.29,40.62
  Top 0.305: 7.62,33.02 JP8.1 | 7.62,40.64 JP6.1 | R23.2 v17.78,28.57 | C2.2 23.06,30.76 20.88,28.57 R23.1 | 7.62,40.64 v8.26,40.64 | 7.62,33.02 v8.91,33.45 | JP7.1 7.62,33.02 | JP1.3 7.62,40.64 | C1.2 v24.77,39.37
  Top 0.406: C2.2 23.82,31.51 U1.1 | U1.1 23.64,33.02 v22.86,33.02 | U1.1 v23.82,34.27 | U1.1 23.35,33.66 v22.86,33.66 | C4.2 C3.2 | v26.67,46.99 J3.1 v24.77,45.09
  Bottom 0.203: C6.2 v9.58,26.67 C5.2 | R20.1 23.44,19.74 J2.7 | L5.2 12.39,80.95 RF-.GND4 | L4.2 16.13,80.95 RF+.GND4 | 5.71,29.84 5.84,29.84 v5.97,29.97 7.04,29.97 7.52,29.49 7.52,29.03 C9.2
  Bottom 0.254: v19.25,27.13 19.05,27.13 19.05,25.4
  Bottom 0.305: 24.77,28.57 24.77,18.41
  Bottom 0.406: v26.67,46.99 24.77,46.99
  other vias: 12.27,30.15 13.08,29.36 13.03,28.65 11.38,30.12 10.57,30.1 9.75,30.1 13.06,27.91 13.13,27.13 13.13,26.29 15.39,25.73 15.42,26.52 15.42,27.33 15.42,28.19 15.42,29.03 15.42,29.87 16.33,30.18 17.22,30.18 18.16,30.25 18.92,30.25 8.99,30.4 12.06,22.86 13.34,22.86 13.34,21.59 12.32,32.56 12.32,33.22 12.29,33.86 12.32,35.46 12.34,36.17 12.29,37.64 9.75,39.55 9.19,40.26 8.15,51.94 8.56,47.19 7.87,47.24 8.59,44.91 9.14,43.56 9.37,42.88 16.05,32.44 16.05,33.07 16.05,33.71 16.08,35.48 16.05,36.22 16.03,37.62 19.02,43.08 19.33,43.81 19.53,44.55 19.63,46.23 19.99,51.87 13.06,30.15 12.24,51.94 14.2,40.61 16.1,51.97 22.86,76.83 22.23,76.83 21.59,76.83 20.95,76.83 20.32,76.83 19.68,76.83 19.05,76.2 18.36,75.69 17.7,75.16 17.07,74.65 16.51,74.3 15.88,74.3 16.51,72.39 16.51,71.12 17.14,71.12 17.78,71.12 17.14,72.39 17.78,72.39 18.57,72.92 19.18,73.51 19.81,74.17 20.32,74.93 20.95,74.93 21.59,74.93 18.62,70.79 19.3,70.13 19.96,69.47 20.32,68.58 20.95,68.58 22.91,66.52 23.6,66.32 19.05,66.04 18.26,66.5 17.58,67.03 16.97,67.54 16.38,68.05 15.88,68.4 15.24,68.58 13.34,69.85 13.34,69.22 13.34,68.58 12.73,68.3 12.14,67.84 11.43,67.31 10.79,66.67 13.13,73.71 12.55,74.12 11.99,74.55 11.43,74.93 10.79,75.56 10.16,76.2 9.53,76.83 8.89,77.47 8.26,78.11 10.03,66.14 9.42,65.61 9.35,64.77 19.68,66.04 8.46,47.9 8.33,48.69 8.28,49.56 8.2,50.42 8.2,51.16 7.98,44.91 7.24,44.88 7.21,47.24 8.92,44.27 19.63,45.42 19.63,47.02 19.68,47.96 19.79,48.82 19.91,49.66 19.99,50.39 20.02,51.16 21.59,68.58 22.4,66.98 23.42,77.42 8,78.77 9.22,63.07 8.59,62.81 19.13,65.33 18.92,64.59 18.9,63.07 19.51,62.76 13.67,75.41 14.66,75.39 13.56,78.38 14.86,78.38 5.97,42.98 5.33,42.98 4.7,42.98 4.32,42.42 2.92,42.39 2.24,42.39 4.55,47.27 4.52,46.35 4.57,45.52
  pour Bottom (isolate 0.406, rank 2): 21.59,56.52 21.59,26.16 15.21,26.16 15.21,31.32 15.9,32.46 15.9,39.37 16.51,39.37 16.51,43.18 17.78,43.18 17.78,43.97 18.62,44.81 20.09,52.48 20.12,52.5 20.12,56.52
  pour Bottom (isolate 0.406, rank 3): 13.23,25.32 13.21,31.42 12.55,32.46 12.55,38.89 arc90 12.06,39.37 12.06,42.55 9.09,43.97 8.28,52.5 8.26,55.88 7.16,55.88 7.14,28.8 11.91,28.8 11.96,25.32
  pour Bottom (isolate 0.406, rank 2): 12.06,52.7 10.87,45.69 10.9,45.03 12.06,43.81 13.97,43.81 13.97,40.01 14.4,40.01 14.43,43.81 16.51,43.81 17.78,45.09 16.13,52.81
  pour Bottom (isolate 0.305, rank 2): 22.53,56.52 22.53,25.4 15.24,25.4 15.24,23.5 13.21,23.5 13.21,24.94 10.16,24.94 10.16,27.94 6.12,27.94 6.12,56.52 0.64,56.52 0.64,26.04 5.71,26.04 6.99,24.77 9.65,24.79 11.43,22.86 6.99,22.86 5.71,21.59 0.64,21.59 0.64,0.64 27.3,0.64 27.3,56.52
  pour Top (isolate 0.305, rank 2, no thermals): 13.34,25.4 13.34,30.48 8.89,30.48 8.89,30.23 9.63,29.51 11.2,29.51 arc-90 11.43,29.29 11.43,28.88 11.96,28.88 11.96,27.94 12.42,27.36 12.42,25.4
  pour Top (isolate 0.406, rank 2): 14.61,25.4 14.61,30.48 15.24,30.48 19.68,30.48 19.68,29.84 17.14,27.3 17.14,25.4
  pour Top (isolate 0.406, rank 2): 6.99,56.52 6.99,31.11 13.34,31.11 13.23,31.37 12.57,32.44 12.57,39.07 10.06,39.07 10.06,43.03 9.14,43.94 9.02,44.78 8.76,47.5 8.36,52.25 8.26,56.52
  pour Top (isolate 0.406, rank 2): 21.59,56.52 21.59,32.38 15.88,32.38 15.88,39.04 18.39,39.04 18.39,43.18 19.33,44.12 19.41,49.23 19.91,52.22 19.91,56.52
  pour Top (isolate 0.406, rank 2): 12.06,56.52 12.06,52.27 11.96,52.27 10.97,46.66 10.9,45.14 11.38,44.48 12.88,44.5 13.18,44.2 13.18,43.76 13.92,43.76 13.92,39.98 14.45,39.98 14.45,43.76 15.14,43.76 15.16,43.79 15.16,44.2 15.47,44.5 17.09,44.5 17.12,44.53 17.53,45.29 17.48,46.76 16.33,52.22 16.48,56.52
  pour Top (isolate 0.305, rank 2): 0.64,82.55 0.64,58.42 27.3,58.42 27.3,82.55 19.96,82.55 19.96,78.18 16.89,75.11 16.26,75.08 14.94,73.61 13.56,73.58 13.51,73.63 11.99,75.08 11.48,75.06 10.95,75.56 8.43,78.05 8.43,82.55
  pour Bottom (isolate 0.406, rank 2): 0.64,82.55 0.64,58.42 8.89,58.42 8.89,62.87 9.53,62.87 9.53,65.41 13.49,68.48 13.49,71.02 14.94,71.02 14.94,68.48 18.72,65.46 18.72,62.74 19.38,62.74 19.38,58.42 27.3,58.42 27.3,66.5 23.9,66.45 22.58,67.16 18.82,67.16 16.13,69.85 15.24,69.85 15.24,73.66 16.89,74.3 19.66,76.43 22.56,76.4 23.88,77.09 27.3,77.06 27.3,82.55 19.94,82.55 19.96,78.21 16.89,75.13 16.31,75.11 14.99,73.79 14.96,72.57 13.44,72.57 13.44,73.69 11.86,74.9 11.48,75.11 8.43,78.16 8.43,82.55
  pour Bottom (isolate 0.406, rank 2): 27.3,68.76 27.3,74.73 23.8,74.73 23.72,74.8 22.02,75.39 20.22,75.39 19.84,74.55 18.21,72.82 16.23,72.57 15.04,72.59 15.04,70.92 16.33,70.99 18.14,70.76 19.81,69.11 20.27,68.2 20.42,68.2 22,68.17 23.7,68.76
  pour Top (isolate 0.305, rank 2): 17.65,83.19 10.79,83.19 11.02,78.84 12.06,77.47 13.03,76.5 13.03,75.77 13.92,74.88 14.3,74.88 15.24,75.82 15.24,76.3 17.58,78.94
  pour Bottom (isolate 0.305, rank 2): 17.55,83.19 10.97,83.21 11.02,78.84 12.06,77.47 13.03,76.5 13.03,75.77 13.92,74.88 14.3,74.88 15.24,75.82 15.24,76.3 17.58,78.92
  pour Top (isolate 0.305, rank 2): 0.64,47.62 0.64,41.91 6.35,41.91 6.35,52.07 0.64,52.07
IN+
  Top 1.016: L2.2 18.77,78.33 RF+.ANT
  pour Top (no thermals): 18.41,78.11 19.15,78.21 19.43,79.38 18.9,80.26 18.11,79.43 18.34,78.61
IN-
  Top 1.016: RF-.ANT 9.75,78.18 L1.2
  pour Top (isolate 0.254, no thermals): 9.53,78.11 9.35,78.13 9.09,78.92 9.09,79.53 10.41,79.53 10.41,79.3 10.11,78.31
LO+
  Top 0.203: C12.2 19.96,67.67 22.86,67.67 | 22.86,67.67 LO+.ANT | R26.2 22.86,67.67
  pour Top (no thermals): 24.77,67.94 24,68.33 22.71,67.67 24,67.01
  pour Top (no thermals): 19.05,68.58 19.3,68.81 19.96,67.67 18.85,68.3
LO-
  Top 0.203: C11.1 20.02,75.89 22.86,75.89 | 22.86,75.89 LO-.ANT | R25.2 22.86,75.89
  pour Top (no thermals): 24.77,76.2 24,76.56 22.71,75.9 24,75.23
  pour Top (no thermals): 19.05,74.93 18.82,75.16 18.82,75.18 20.02,75.9 19.3,74.7
MIX_EN  (via drill 0.25 pad 0.25)
  Top 0.203: 8.26,73.03 Q1.3 | 8.26,73.03 v12.7,73.03 | v15.11,73.79 14.96,73.63 U$9.2 | R24.1 8.26,73.03
  Bottom 0.203: v12.7,73.03 14.35,73.03 v15.11,73.79
MIX_EN_3V3
  Top 0.203: Q1.1 4.79,73.66 J5.2
N98  (via drill 0.25 pad 0.25)
  Top 0.203: U$9.4 13.96,73.98 L1.1 12.43,77.11 L3.2 13.35,76.21 v13.34,76.2
  Bottom 0.203: v13.34,76.2 12.43,76.2 L5.1
N$1  (via drill 0.3 pad 0.25)
  Top 0.305: v18.67,41.15 20.07,42.55 JP2.2
  Bottom 0.305: U$2.3 v18.67,41.15
N$2  (via drill 0.3 pad 0.25)
  Top 0.305: v9.7,41.17 8.33,42.55 JP1.2
  Bottom 0.203: 9.73,41.15 arc-90 v9.7,41.17
  Bottom 0.305: U$2.6 9.73,41.15
N$3  (via drill 0.41 pad 0.61)
  Top 0.203: R9.1 14.88,38.38 | 15.24,39.88 R11.1 R12.1
  Top 0.254: R7.2 14.88,38.38 | 15.24,39.88 v15.21,39.85
  Top 0.61: v15.21,39.85 14.88,39.52 R7.2
  Bottom 0.61: U$2.4 15.24,39.88 v15.21,39.85
N$4
  Top 0.203: R5.1 14.88,34.67
  Top 0.254: 14.88,34.67 R3.2
  Top 0.61: R3.2 R7.1
N$5
  Top 0.203: R1.1 14.45,31.37
  Top 0.254: U$1.1 14.45,31.37 14.45,31.83 R3.1
  pour Top (no thermals): 14.83,33.32 14.55,33.22 14.45,31.85 15.21,33.17
N$6  (via drill 0.41 pad 0.61)
  Top 0.203: R10.1 13.51,38.38 | R16.1 R15.1 13.16,39.88
  Top 0.254: R8.2 13.51,38.38 | 13.16,39.88 v13.18,39.85
  Top 0.61: v13.18,39.85 13.51,39.52 R8.2
  Bottom 0.61: U$2.5 13.16,39.88 v13.18,39.85
N$7
  Top 0.203: R6.1 13.51,34.65
  Top 0.254: 13.51,34.65 R4.2
  Top 0.61: R4.2 R8.1
N$8
  Top 0.203: R2.1 13.95,31.37
  Top 0.254: U$1.2 13.95,31.37 13.95,31.82 R4.1
  pour Top (no thermals): 13.36,33.27 13.84,33.22 13.94,31.85 13.18,33.12
N$9
  Top 0.203: R9.2 19.02,38.73 JP3.2
N$10
  Top 0.203: R5.2 18.92,34.92 JP4.2
N$11
  Top 0.203: R1.2 17.55,31.11 JP5.2
N$12
  Top 0.203: JP8.2 10.85,31.11 R2.2
N$13
  Top 0.203: JP7.2 9.45,34.92 R6.2
N$14
  Top 0.203: JP6.2 9.38,38.73 R10.2
N$15  (via drill 0.25 pad 0.25)
  Bottom 0.254: A-.ANT v18.19,58.42
  Bottom 0.305: R13.2 18.44,54.36 A-.ANT
  pour Bottom (no thermals): 18.21,46.46 18.11,47.07 17.55,52.58 18.82,52.58 18.77,47.07
N$16  (via drill 0.25 pad 0.25)
  Bottom 0.254: A+.ANT v10.16,58.42
  pour Bottom (no thermals): 10.16,46.35 9.58,46.91 9.53,52.6 10.79,52.6 10.24,47.07
N$20
  Top 0.203: 15.5,73.11 U$9.1 C11.2
  pour Top (no thermals): 17.78,73.66 17.42,73.79 15.54,73.23 15.54,72.97 17.93,73.3
N$21  (via drill 0.25 pad 0.25)
  Top 0.203: U$1.3 U$1.4 12.95,25.15 12.47,25.63 12.47,27.3 11.66,28.17 10.21,28.17 9.55,28.83 C10.1 7.57,28.8 C7.1
  other vias: 7.57,27.3
N$22
  Bottom 0.203: 20.32,22.23 R19.1 | 20.32,22.23 R20.2 | J2.5 20.32,22.23
N$23  (via drill 0.25 pad 0.25)
  Top 0.203: U$1.5 U$1.6 | 11.94,24.57 U$1.6 | U$1.6 12.06,24.57 12.06,27.18 11.43,27.81 v8.66,27.81
  Bottom 0.203: C9.1 6.43,27.33 C7.2 6.41,28.07 8.66,28.07 v8.66,27.81
  other vias: 6.41,27.3
N$24
  Top 0.203: C12.1 U$9.8
  pour Top (no thermals): 17.78,69.85 17.88,70.23 15.54,70.54 15.54,70.28 17.4,69.75
N$25  (via drill 0.25 pad 0.25)
  Top 0.203: U$9.3 14.46,74.02 L2.1 15.94,77.11 L3.1 15.05,76.16 v15.04,76.15
  Bottom 0.203: v15.04,76.15 16.11,76.15 L4.1
N$26  (via drill 0.25 pad 0.25)
  Top 0.203: U$9.5 13.96,68.21 12.33,66.58 | 12.33,66.58 C14.1 | v12.7,66.19 12.7,66.22 12.33,66.58
  Bottom 0.203: L6.1 v12.7,66.19
  pour Top (no thermals): 10.79,64.77 10.29,65.3 13.92,68.17 10.77,65.02
N$27  (via drill 0.25 pad 0.25)
  Top 0.203: U$9.6 14.46,68.22 16.1,66.57 | 16.1,66.57 C13.1 | v15.72,66.17 15.72,66.19 16.1,66.57
  Bottom 0.203: L7.2 v15.72,66.17
  pour Top (no thermals): 17.78,64.77 18.14,65.28 14.5,68.17 17.65,65.02
N$30
  Bottom 0.203: 20.32,24.77 R18.1 | 20.32,24.77 R19.2 | J2.3 20.32,24.77
N$37  (via drill 0.25 pad 0.25)
  Top 0.203: L8.1 21.96,65.05 GND.2
  other vias: 21.62,65.05
N$38  (via drill 0.25 pad 0.25)
  Top 0.203: L9.2 JP10.2
  other vias: 7.62,67.59
N$39  (via drill 0.25 pad 0.25)
  Top 0.254: U2.6 v5.75,42.13 arc90 v5.74,42.14
  Bottom 0.203: v5.74,42.14 6.35,41.53 6.35,38.73 5.71,38.1 A0_SELECT.2
N$98
  pour Top (no thermals): 11.43,76.2 12.29,76.2 13.94,73.99 11.71,75.67
OEN  (via drill 0.25 pad 0.25)
  Top 0.203: U$1.11 9.64,22.98 v8.89,22.23 | v8.48,13.03 8.48,6.12 8.89,5.71 8.89,3.17 J1.7
  Bottom 0.203: v8.89,22.23 8.89,13.44 v8.48,13.03
OF
  Top 0.203: U$1.28 17.29,21.98 22.25,17.02 22.25,3.83 J1.15
OUT+
  Top 0.305: IF+.ANT 17.78,60.33 | C13.2 17.78,63.87 L8.2
  Top 0.813: C13.2 17.83,60.33 IF+.ANT
OUT-
  Top 0.305: 10.64,60.33 IF-.ANT | C14.2 10.64,63.87 L9.1
  Top 0.813: IF-.ANT 10.49,60.68 C14.2
SCL_3V3  (via drill 0.25 pad 0.25)
  Top 0.203: v7.85,25.4 6.99,25.4 2.81,29.57 Q4.2 | J1.11 13.97,3.17 v13.97,14.61
  Top 0.254: R29.1 1.27,31.43 Q4.2
  Bottom 0.203: v7.85,25.4 11.43,21.82 11.43,17.12 13.95,14.61 v13.97,14.61
SCL_5V  (via drill 0.25 pad 0.25)
  Top 0.254: U2.5 4.45,40.64 4.45,38.71 3.81,38.08 3.81,33.48 Q4.3
  Top 0.305: Q4.3 4.91,32.61 R27.2
  other vias: 4.5,33.02
SDA_3V3  (via drill 0.25 pad 0.25)
  Top 0.203: Q5.2 2.81,34.92 v1.85,33.96 | v11.43,14.61 11.43,3.17 J1.9
  Top 0.254: R30.2 1.53,35.24 Q5.2
  Bottom 0.203: v1.85,33.96 1.85,30.53 10.79,21.59 10.79,15.24 v11.43,14.61
SDA_5V  (via drill 0.25 pad 0.25)
  Top 0.254: U2.4 5.75,37.03 Q5.3
  Top 0.305: Q5.3 4.91,35.97 R28.1
  other vias: 4.5,35.56
SMP_CLK  (via drill 0.3 pad 0.25)
  Top 0.203: CLK.ANT | R17.2 10.35,25.45 U$1.9
  Top 0.305: CLK.ANT 8.26,23.98 | 8.26,23.98 v6.35,22.23 | 8.26,23.98 U$1.9
  Bottom 0.305: v6.35,22.23 3.81,17.78 3.81,3.17 J1.1
  pour Top (no thermals): 3.81,24.13 4.5,24.64 5.79,23.98 4.5,23.32
VCCA  (via drill 0.25 pad 0.25)
  Top 0.203: 20.95,66.98 20.98,66.98 | 15.27,69.85 15.24,69.85 | v12.7,70.48 12.64,70.43 C16.2
  Top 0.254: U2.3 1.27,39.69 C17.1 C18.1
  Top 0.305: JP2.1 JP3.1 20.7,39.37 v18.95,39.37 | U$9.7 14.96,70.13 | 14.96,70.13 15.24,69.85 15.37,69.75 | 20.95,66.98 18.95,66.98 15.37,69.75 | 20.95,66.98 23,64.94 23,63.99 | 23,63.99 23,40.5 | v14.99,69.62 15.37,69.75 | 15.37,69.75 15.27,69.85 | R24.2 8.26,70.43 | U2.3 3.17,39.66 v3.17,38.73 | 23.64,41.13 24.13,41.63 24.13,49.53 25.22,50.8 25.22,61.59 23.16,63.83 | 23.16,63.83 23,63.99 | 23.16,63.83 23.19,63.83 23.19,65.05 21.26,66.98 20.95,66.98 | 20.95,66.98 20.95,66.83 19,66.83 15.65,69.52 | 14.96,69.67 14.96,70.13
  Top 0.406: 22.05,39.55 JP3.1 | 24.07,37.52 C1.1 24.77,36.83 | 22.05,39.55 24.07,37.52 | 24.77,36.83 U1.3 | 24.07,37.52 24.77,36.83 | J3.2 25.04,42.55 23.64,41.13 23,40.5 22.05,39.55 | J4.2 2.6,70.43 8.26,70.43 C15.2 C16.2
  Bottom 0.203: 14.2,70.48 14.15,70.48
  Bottom 0.254: A0_SELECT.1 5.66,37.29 R28.2 R27.1
  Bottom 0.305: 14.15,70.48 v12.7,70.48 | L6.2 14.2,63.92 | 14.2,63.92 L7.1 | 14.2,63.92 14.2,69.62 | 14.2,70.48 14.2,69.85 14.2,69.62 | v18.95,39.37 18.54,38.96 7.85,38.96 6.17,37.29 A0_SELECT.1 3.99,37.29 3.17,38.1 v3.17,38.73 | 14.2,69.62 v14.99,69.62
VCM  (via drill 0.3 pad 0.25, 0.3 pad 0.41)
  Top 0.305: U$1.31 17.12,23.48 v17.78,24.13 | 20.88,36.83 JP3.3 | 20.88,36.83 JP4.3 21.92,35.74 21.92,30.3 JP5.3 | JP8.3 6.58,30.3 6.58,35.74 JP7.3 7.62,36.83 | JP6.3 7.62,36.83 | 7.62,36.83 v8.89,36.83 | v20.32,36.83 20.88,36.83
  Bottom 0.305: U$2.2 18.54,42.42 19.68,41.27 19.68,36.83 | v17.78,24.13 17.78,27.3 19.68,29.21 19.68,36.83 | v8.89,36.83 19.68,36.83 | 19.68,36.83 v20.32,36.83
VGC
  Top 0.254: U2.1 3.81,42.26 3.81,45.72 | Q2.1 3.81,49.23 3.81,45.72 | 3.81,45.72 3.81,45.4 Q3.1

### Text on the board
bNames: Connect to TP1 | TP1